# Altium schematic sheet Sheet1.SchDoc
size A3; SheetNumber: 1; SheetTotal: 1
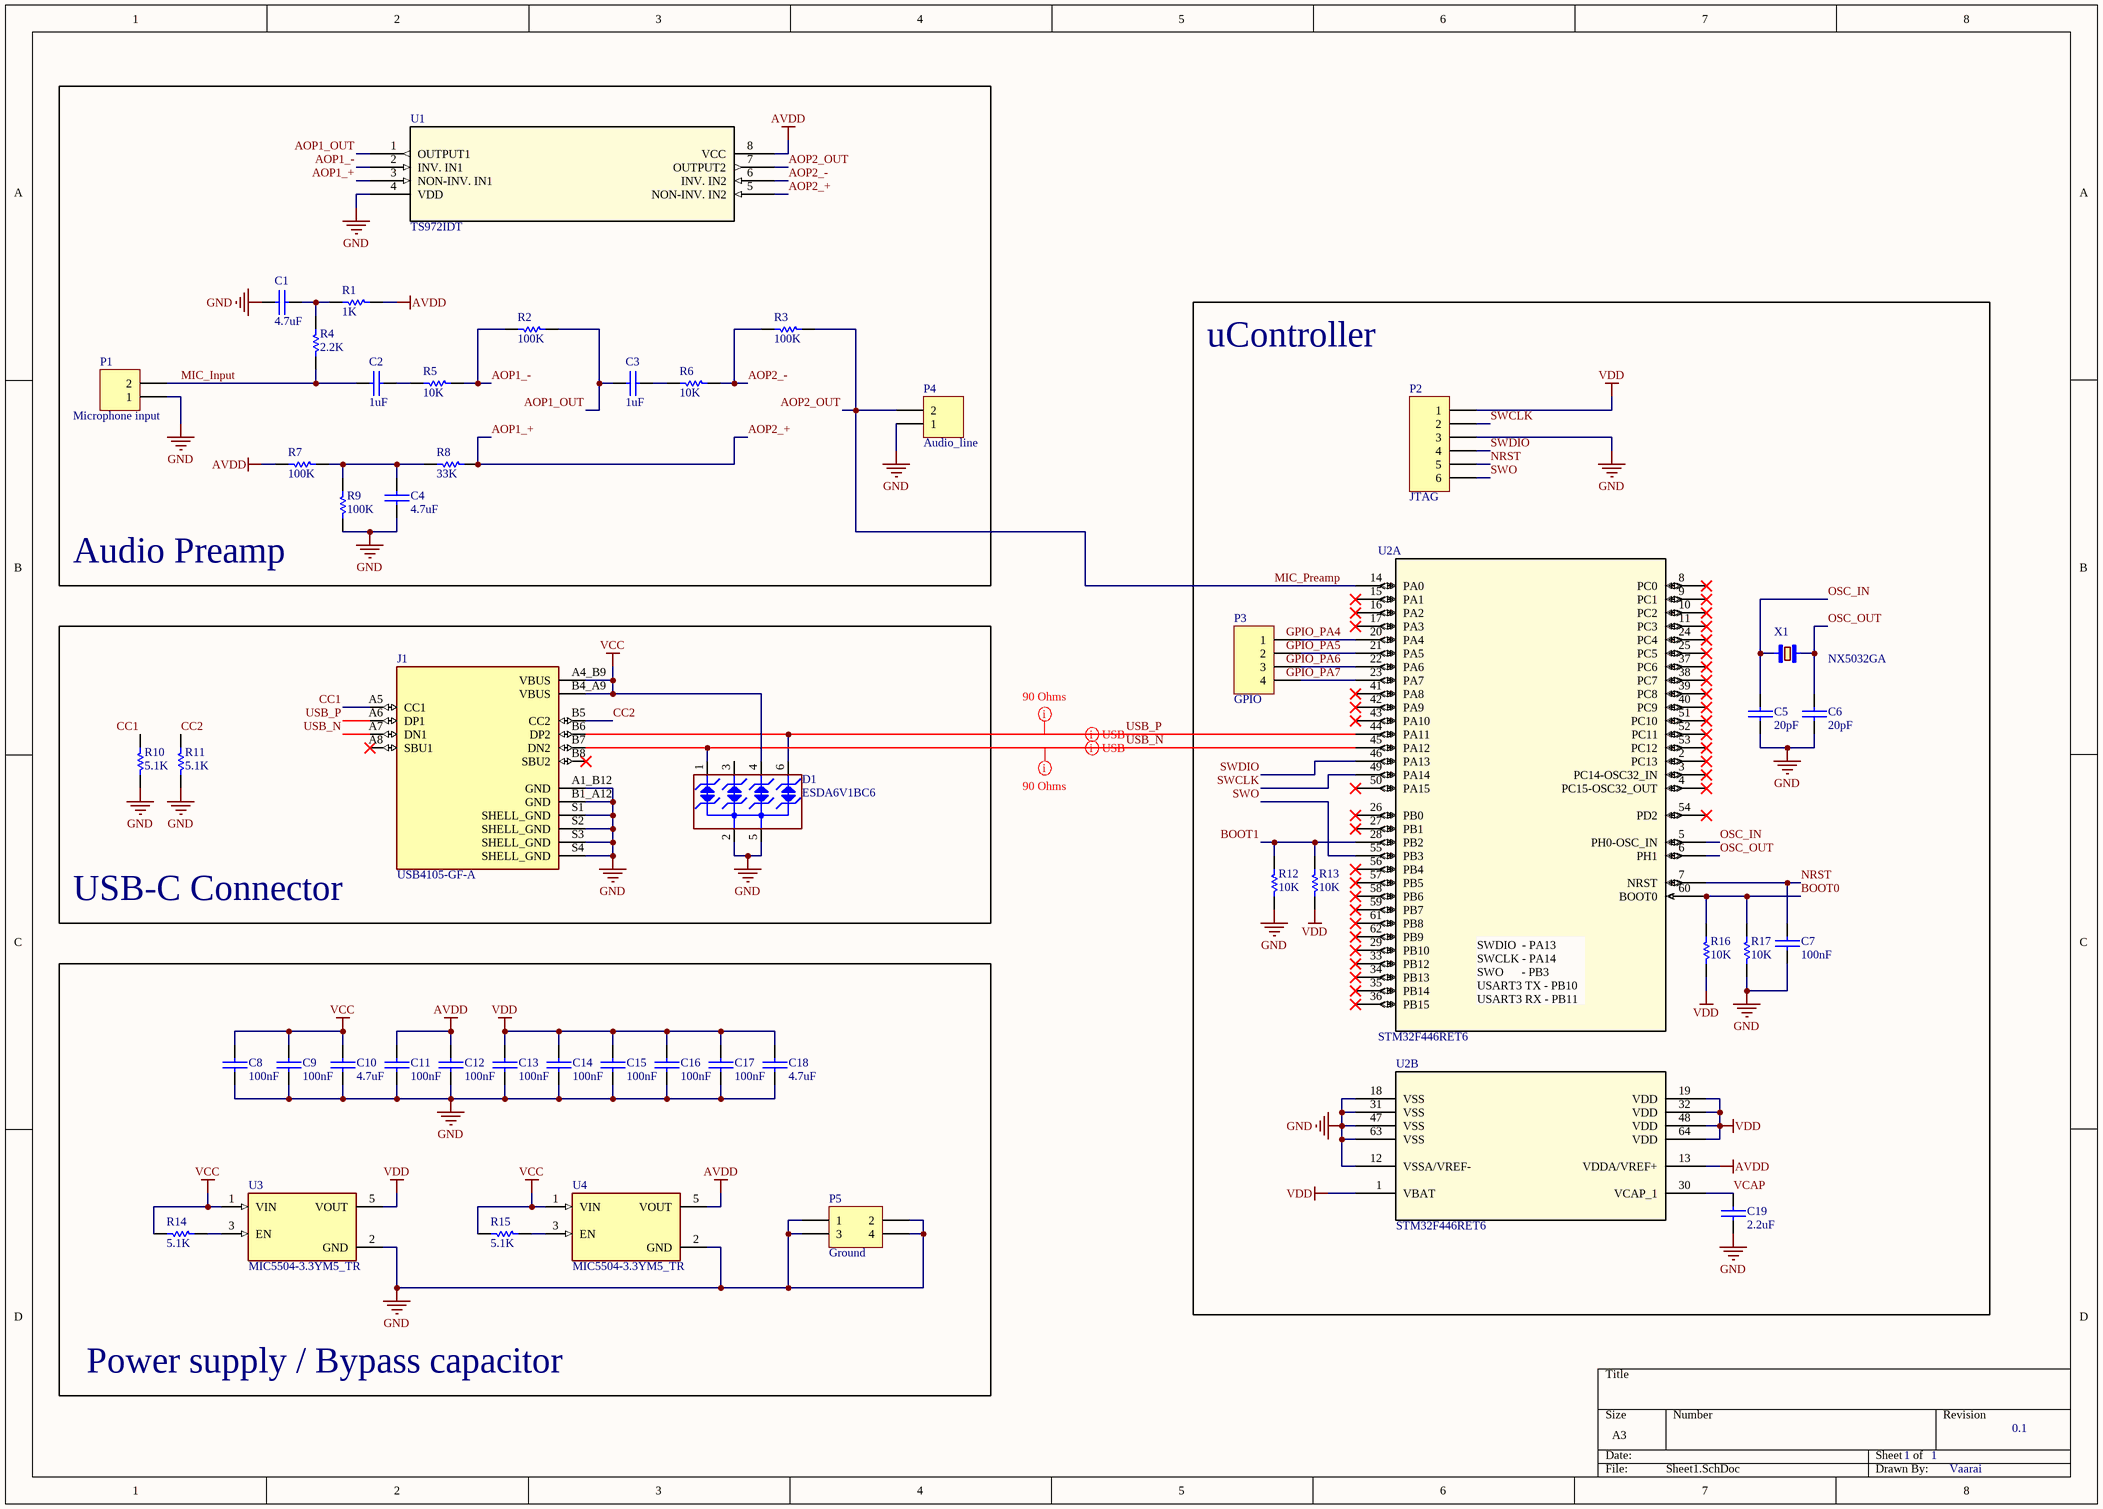
[diagram p0: Sheet1.SchDoc]

## Parts
C1  4.7uF  [0603C]
C2  1uF  [0603C]
C3  1uF  [0603C]
C4  4.7uF  [0603C]
C5  20pF  [0603C]
C6  20pF  [0603C]
C7  100nF  [0603C]
C8  100nF  [0603C]
C9  100nF  [0603C]
C10  4.7uF  [0603C]
C11  100nF  [0603C]
C12  100nF  [0603C]
C13  100nF  [0603C]
C14  100nF  [0603C]
C15  100nF  [0603C]
C16  100nF  [0603C]
C17  100nF  [0603C]
C18  4.7uF  [0603C]
C19  2.2uF  [0603C]
D1  ESDA6V1BC6  [IC_IC-DP_SOT23-6L]
J1  USB4105-GF-A  [GCT_USB4105-GF-A]
P1  Microphone input  [HDR1X2]
P2  JTAG  [HDR1X6]
P3  GPIO  [HDR1X4]
P4  Audio_line  [HDR1X2]
P5  Ground  [HDR2X2]
R1  1K  [0603R]
R2  100K  [0603R]
R3  100K  [0603R]
R4  2.2K  [0603R]
R5  10K  [0603R]
R6  10K  [0603R]
R7  100K  [0603R]
R8  33K  [0603R]
R9  100K  [0603R]
R10  5.1K  [0603R]
R11  5.1K  [0603R]
R12  10K  [0603R]
R13  10K  [0603R]
R14  5.1K  [0603R]
R15  5.1K  [0603R]
R16  10K  [0603R]
R17  10K  [0603R]
U1  TS972IDT  [SO-8_STM]
U2  STM32F446RET6  [LQFP64-10x10mm]  (parts A,B of 2)
U3  MIC5504-3.3YM5_TR  [SOT95P280X145-5N]
U4  MIC5504-3.3YM5_TR  [SOT95P280X145-5N]
X1  NX5032GA  [2-SMD-5X3]

## Blocks framed on the sheet
Audio Preamp: C1-C4 P1 P4 R1-R9 U1
uController: C5-C7 C19 P2 P3 R12 R13 R16 R17 U2 X1
USB-C Connector: D1 J1 R10 R11
Power supply / Bypass capacitor: C8-C18 P5 R14 R15 U3 U4

## Nets
AVDD: C11.1 C12.1 R1.2 R7.2 U1.8(VCC) U2.13(VDDA/VREF+) U4.5(VOUT)
GND: C1.2 C4.2 C5.2 C6.2 C7.2 C8.2 C9.2 C10.2 C11.2 C12.2 C13.2 C14.2 C15.2 C16.2 C17.2 C18.2 C19.2 D1.2(IO2) D1.5(IO4) J1.A1_B12(GND) J1.B1_A12(GND) J1.S1(SHELL_GND) J1.S2(SHELL_GND) J1.S3(SHELL_GND) J1.S4(SHELL_GND) P1.1 P2.3 P4.1 P5.1 P5.2 P5.3 P5.4 R9.1 R10.1 R11.2 R12.1 R17.1 U1.4(VDD) U2.12(VSSA/VREF-) U2.18(VSS) U2.31(VSS) U2.47(VSS) U2.63(VSS) U3.2(GND) U4.2(GND)
VCC: C8.1 C9.1 C10.1 D1.4(IO3) J1.A4_B9(VBUS) J1.B4_A9(VBUS) R14.1 R15.1 U3.1(VIN) U4.1(VIN)
VDD: C13.1 C14.1 C15.1 C16.1 C17.1 C18.1 P2.1 R13.1 R16.1 U2.1(VBAT) U2.19(VDD) U2.32(VDD) U2.48(VDD) U2.64(VDD) U3.5(VOUT)
AOP1_+: R8.2 U1.3(NON-INV._IN1) U1.5(NON-INV._IN2)  [also labelled AOP2_+]
AOP1_-: R2.1 R5.2 U1.2(INV._IN1)
AOP1_OUT: C3.1 R2.2 U1.1(OUTPUT1)
AOP2_-: R3.1 R6.2 U1.6(INV._IN2)
AOP2_OUT: P4.2 R3.2 U1.7(OUTPUT2) U2.14(PA0)  [also labelled MIC_Preamp]
BOOT0: R16.2 R17.2 U2.60(BOOT0)
BOOT1: R12.2 R13.2 U2.28(PB2)
CC1: J1.A5(CC1) R10.2
CC2: J1.B5(CC2) R11.1
GPIO_PA4: P3.1 U2.20(PA4)
GPIO_PA5: P3.2 U2.21(PA5)
GPIO_PA6: P3.3 U2.22(PA6)
GPIO_PA7: P3.4 U2.23(PA7)
MIC_Input: C2.1 P1.2 R4.1
NRST: C7.1 P2.5 U2.7(NRST)
OSC_IN: C5.1 U2.5(PH0-OSC_IN) X1.1
OSC_OUT: C6.1 U2.6(PH1) X1.2
SWCLK: P2.2 U2.49(PA14)
SWDIO: P2.4 U2.46(PA13)
SWO: P2.6 U2.55(PB3)
USB_N: D1.1(IO1) J1.A7(DN1) J1.B7(DN2) U2.45(PA12)
USB_P: D1.6(NC) J1.A6(DP1) J1.B6(DP2) U2.44(PA11)
VCAP: C19.1 U2.30(VCAP_1)
NetC1_1: C1.1 R1.1 R4.2
NetC2_2: C2.2 R5.1
NetC3_2: C3.2 R6.1
NetC4_1: C4.1 R7.1 R8.1 R9.2
NetR14_2: R14.2 U3.3(EN)
NetR15_2: R15.2 U4.3(EN)

Not connected (* = marked no-connect by the designer): D1 3(GND); J1 A8(SBU1)* B8(SBU2)*; U2 2(PC13)* 3(PC14-OSC32_IN)* 4(PC15-OSC32_OUT)* 8(PC0)* 9(PC1)* 10(PC2)* 11(PC3)* 15(PA1)* 16(PA2)* 17(PA3)* 24(PC4)* 25(PC5)* 26(PB0)* 27(PB1)* 29(PB10)* 33(PB12)* 34(PB13)* 35(PB14)* 36(PB15)* 37(PC6)* 38(PC7)* 39(PC8)* 40(PC9)* 41(PA8)* 42(PA9)* 43(PA10)* 50(PA15)* 51(PC10)* 52(PC11)* 53(PC12)* 54(PD2)* 56(PB4)* 57(PB5)* 58(PB6)* 59(PB7)* 61(PB8)* 62(PB9)*

## Layout directives
differential pair: USB_N, USB_P
mark named 90 Ohms: USB_N, USB_P

## Notes on the sheet
- (near U2) SWDIO  - PA13
  SWCLK - PA14
  SWO      - PB3
  USART3 TX - PB10
  USART3 RX - PB11
- 1
- 0.1
- Vaarai

## Library data of the parts
C1-C19 = CAP: Capacitor
D1 = ESDA6V1BC6: 4-line ESD protection; Manuf_1: STM; Manuf_Part_1: ESDA5V3L; Ref St: 9179034; Provided: ST; ECCN_US/EU: EAR99/NEC; Distrib: ST; Order: ESDA5V3L; Ordered by: STM
J1 = USB4105-GF-A: USB-C (USB TYPE-C) USB 2.0 Receptacle Connector 24 (16+8 Dummy) Position Surface Mount, Right Angle; Through Hole; MF: GCT; Price: None; Value: *; MP: USB4105-GF-A; Package: None; Purchase-URL: https://pricing.snapeda.com/search/part/USB4105-GF-A/?ref=eda; SnapEDA_Link: https://www.snapeda.com/parts/USB4105-GF-A/Global%20Connector%20Technology/view-part/4423780/?ref=snap; Check_prices: https://www.snapeda.com/parts/USB4105-GF-A/Global%20Connector%20Technology/view-part/4423780/?ref=eda; Availability: Warning
P1 P4 = Header 2: Header, 2-Pin; LatestRevisionDate: 17-Jul-2002; LatestRevisionNote: Re-released for DXP Platform.; Publisher: Altium Limited
P2 = Header 6: Header, 6-Pin; LatestRevisionDate: 17-Jul-2002; LatestRevisionNote: Re-released for DXP Platform.; Publisher: Altium Limited
P3 = Header 4: Header, 4-Pin; LatestRevisionDate: 17-Jul-2002; LatestRevisionNote: Re-released for DXP Platform.; Publisher: Altium Limited
P5 = Header 2X2: Header, 2-Pin, Dual row; LatestRevisionDate: 17-Jul-2002; LatestRevisionNote: Re-released for DXP Platform.; Publisher: Altium Limited
R1-R9 R12 R13 R16 R17 = Res1: Resistor; Published: 8-Jun-2000; Revision: July-2002: Re-released for DXP Platform.; Publisher: Altium Limited
  R1: Value: 1K
  R2 R3 R7 R9: Value: 100K
  R4: Value: 2.2K
  R5 R6 R12 R13 R16 R17: Value: 10K
  R8: Value: 33K
R10 R11 R14 R15 = Res1: Resistor; Value: 100K; Published: 8-Jun-2000; Revision: July-2002: Re-released for DXP Platform.; Publisher: Altium Limited
U1 = TS972IDT: No Description Available; Mfr_Name: STMicroelectronics; Copyright: Copyright (C) 2021 Ultra Librarian. All rights reserved.; Manufacturer_Part_Number: TS972IDT; RefDes: RefDes; Type: DEV
U2 = STM32F446RET6: No Description Available; Mfr_Name: STMicroelectronics; Copyright: Copyright (C) 2021 Ultra Librarian. All rights reserved.; Manufacturer_Part_Number: STM32F446RET6; RefDes: RefDes; Type: DEV
U3 U4 = MIC5504-3.3YM5_TR: Linear Voltage Regulator IC 1 Output 300mA SOT-23-5; MF: Microchip; MP: MIC5504-3.3YM5 TR; Availability: Unavailable; Check_prices: https://www.snapeda.com/parts/MIC5504-3.3YM5%20TR/Microchip/view-part/423262/?ref=eda; SnapEDA_Link: https://www.snapeda.com/parts/MIC5504-3.3YM5%20TR/Microchip/view-part/423262/?ref=snap; Value: *; Price: None; Package: SOT-23 Microchip
X1 = NX5032GA: 16MHz Â±50ppm Crystal 8pF 120 Ohms 2-SMD, No Lead; MF: NDK America,; MP: NX5032GA; Price: None; SnapEDA_Link: https://www.snapeda.com/parts/NX5032GA/NDK%20America%2C%20Inc./view-part/511653/?ref=snap; Package: SMD-2 NDK America,; Value: *; Availability: Unavailable